# EAGLE design Pure Digit (EAGLE 9.2.2)

## Sheet 1 of 4: Microprocessor
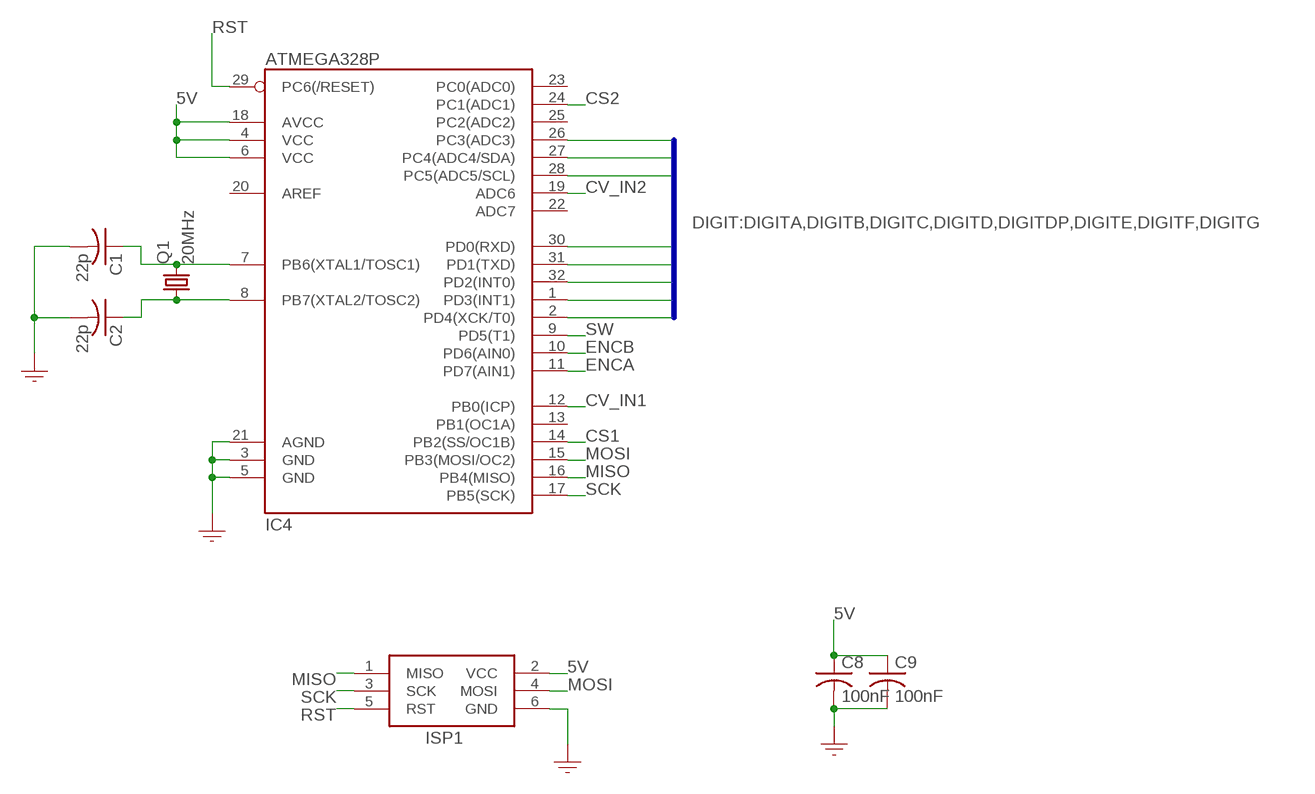
[diagram p0: schematic, sheet 1]

### Parts
C1  22p  CAPACITOR-USC0805  [C0805]
C2  22p  CAPACITOR-USC0805  [C0805]
C8  100nF  CAPACITOR-USC0805  [C0805]
C9  100nF  CAPACITOR-USC0805  [C0805]
IC4  ATMEGA328P  MICROPROCESSOR_ATMEGA328_SMT  [TQFP32-08]
ISP1  HEADER2X3-6  [AVRISP]
Q1  20MHz  CRYSTALSM49  [SM49]

### Nets
5V: C8.1 C9.1 IC4.4(VCC) IC4.6(VCC) IC4.18(AVCC) ISP1.2(VCC) ; also sheet 2,3,4
CS1: IC4.14(PB2(SS/OC1B)) ; also sheet 4
CS2: IC4.24(PC1(ADC1)) ; also sheet 3
CV_IN1: IC4.12(PB0(ICP)) ; also sheet 3
CV_IN2: IC4.19(ADC6) ; also sheet 3
DIGITA: IC4.30(PD0(RXD)) ; also sheet 4
DIGITB: IC4.28(PC5(ADC5/SCL)) ; also sheet 4
DIGITC: IC4.27(PC4(ADC4/SDA)) ; also sheet 4
DIGITD: IC4.26(PC3(ADC3)) ; also sheet 4
DIGITDP: IC4.1(PD3(INT1)) ; also sheet 4
DIGITE: IC4.2(PD4(XCK/T0)) ; also sheet 4
DIGITF: IC4.32(PD2(INT0)) ; also sheet 4
DIGITG: IC4.31(PD1(TXD)) ; also sheet 4
ENCA: IC4.11(PD7(AIN1)) ; also sheet 3
ENCB: IC4.10(PD6(AIN0)) ; also sheet 3
GND: C1.2 C2.2 C8.2 C9.2 IC4.3(GND) IC4.5(GND) IC4.21(AGND) ISP1.6(GND) ; also sheet 2,3,4
MISO: IC4.16(PB4(MISO)) ISP1.1(MISO) ; also sheet 3
MOSI: IC4.15(PB3(MOSI/OC2)) ISP1.4(MOSI) ; also sheet 3,4
N$1: C1.1 IC4.7(PB6(XTAL1/TOSC1)) Q1.2
N$2: C2.1 IC4.8(PB7(XTAL2/TOSC2)) Q1.1
RST: IC4.29(PC6(/RESET)) ISP1.5(RST)
SCK: IC4.17(PB5(SCK)) ISP1.3(SCK) ; also sheet 3,4
SW: IC4.9(PD5(T1)) ; also sheet 3
Unconnected: IC4.13(PB1(OC1A)) IC4.20(AREF) IC4.22(ADC7) IC4.23(PC0(ADC0)) IC4.25(PC2(ADC2))

### Buses
DIGIT:DIGITA,DIGITB,DIGITC,DIGITD,DIGITDP,DIGITE,DIGITF,DIGITG

## Sheet 2 of 4: Power
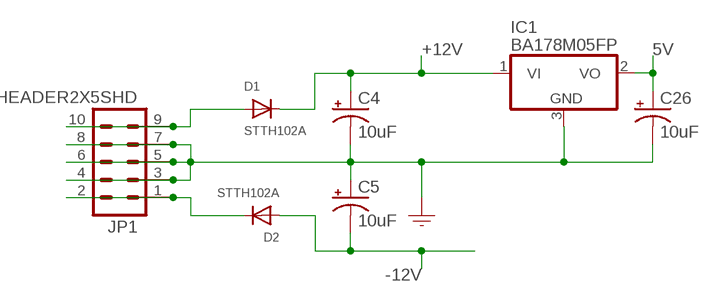
[diagram p1: schematic, sheet 2]

### Parts
C4  10uF  CAPACITOR_POL-US153CLV-0505  [153CLV-0505]
C5  10uF  CAPACITOR_POL-US153CLV-0505  [153CLV-0505]
C26  10uF  CAPACITOR_POL-US153CLV-0505  [153CLV-0505]
D1  STTH102A  DIODESMA  [SMADIODE]
D2  STTH102A  DIODESMA  [SMADIODE]
IC1  BA178M05FP  VOLTAGE_REG_POS05DT  [TO252]
JP1  HEADER2X5SHD  [2X5-SHROUDED]

### Nets
5V: C26.+ IC1.2(VO) ; also sheet 1,3,4
+12V: C4.+ D1.C IC1.1(VI) ; also sheet 3
-12V: C5.- D2.A ; also sheet 3
GND: C4.- C5.+ C26.- IC1.3(GND) JP1.3 JP1.4 JP1.5 JP1.6 JP1.7 JP1.8 ; also sheet 1,3,4
N$9: D1.A JP1.9 JP1.10
N$10: D2.C JP1.1 JP1.2

## Sheet 3 of 4: Inputs
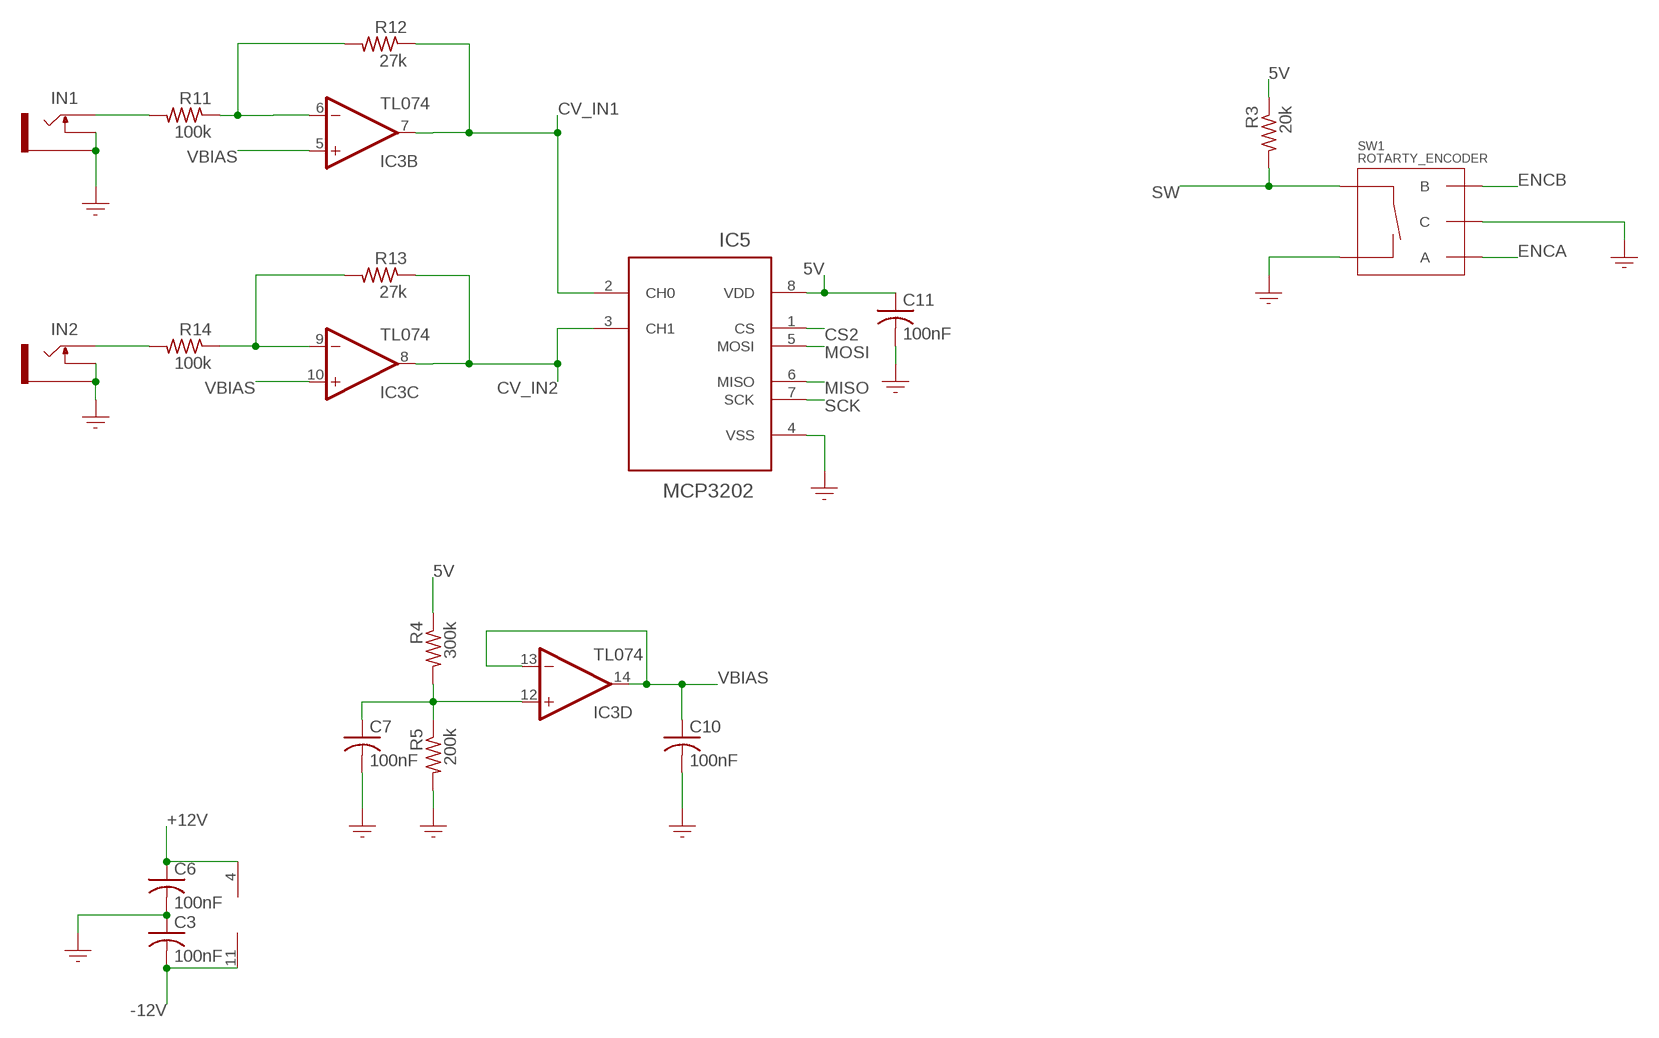
[diagram p2: schematic, sheet 3]

### Parts
C3  100nF  CAPACITOR-USC0805  [C0805]
C6  100nF  CAPACITOR-USC0805  [C0805]
C7  100nF  CAPACITOR-USC0805  [C0805]
C10  100nF  CAPACITOR-USC0805  [C0805]
C11  100nF  CAPACITOR-USC0805  [C0805]
IC3  TL074  OPAMP_QUADD  [SO14]
IC5  MCP3202  ADC_DUAL_12B_MCP3202  [SOIC--8]
IN1  PJ301M-12  SOCKET_MONO_3.5MMPJ301M-12  [PJ301M-12]
IN2  PJ301M-12  SOCKET_MONO_3.5MMPJ301M-12  [PJ301M-12]
R3  20k  RESISTOR_USR0805  [R0805]
R4  300k  RESISTOR_USR0805  [R0805]
R5  200k  RESISTOR_USR0805  [R0805]
R11  100k  RESISTOR_USR0805  [R0805]
R12  27k  RESISTOR_USR0805  [R0805]
R13  27k  RESISTOR_USR0805  [R0805]
R14  100k  RESISTOR_USR0805  [R0805]
SW1  ROTARTY_ENCODER  [ROTARY_ENC_PLAIN]

### Nets
5V: C11.1 IC5.8(VDD) R3.1 R4.1 ; also sheet 1,2,4
+12V: C6.1 IC3.4(P:V+) ; also sheet 2
-12V: C3.2 IC3.11(P:V-) ; also sheet 2
CS2: IC5.1(CS) ; also sheet 1
CV_IN1: IC3.7(B:OUT) IC5.2(CH0) R12.1 ; also sheet 1
CV_IN2: IC3.8(C:OUT) IC5.3(CH1) R13.1 ; also sheet 1
ENCA: SW1.A ; also sheet 1
ENCB: SW1.B ; also sheet 1
GND: C3.1 C6.2 C7.2 C10.2 C11.2 IC5.4(VSS) IN1.GND(SLEEVE) IN1.NORM(SWITCH) IN2.GND(SLEEVE) IN2.NORM(SWITCH) R5.2 SW1.C SW1.SW- ; also sheet 1,2,4
MISO: IC5.6(MISO) ; also sheet 1
MOSI: IC5.5(MOSI) ; also sheet 1,4
N$8: IN1.TIP R11.2
N$11: IN2.TIP R14.2
N$12: C7.1 IC3.12(D:+IN) R4.2 R5.1
N$20: IC3.6(B:-IN) R11.1 R12.2
N$24: IC3.9(C:-IN) R13.2 R14.1
SCK: IC5.7(SCK) ; also sheet 1,4
SW: R3.2 SW1.SW+ ; also sheet 1
VBIAS: C10.1 IC3.5(B:+IN) IC3.10(C:+IN) IC3.13(D:-IN) IC3.14(D:OUT)

## Sheet 4 of 4: Outputs
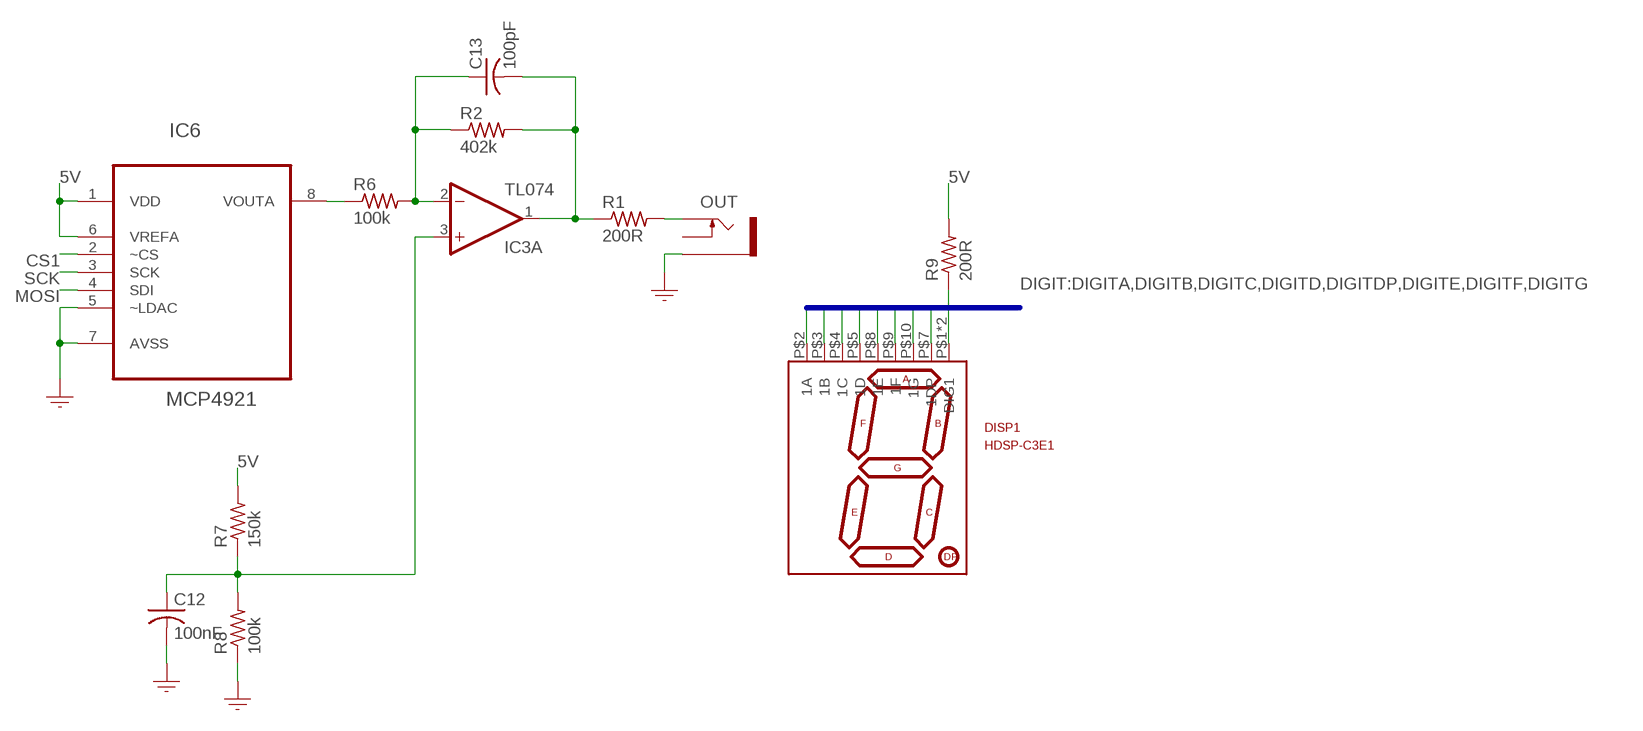
[diagram p3: schematic, sheet 4]

### Parts
C12  100nF  CAPACITOR-USC0805  [C0805]
C13  100pF  CAPACITOR-USC0805  [C0805]
DISP1  HDSP-C3E1  DISPLAY_7-SEGMENT-1DIGIT  [7-SEGMENT-1DIGIT]
IC6  MCP4921  DAC_SINGLE_12B_MCP4921  [SOIC8]
OUT  PJ301M-12  SOCKET_MONO_3.5MMPJ301M-12  [PJ301M-12]
R1  200R  RESISTOR_USR0805  [R0805]
R2  402k  RESISTOR_USR0805  [R0805]
R6  100k  RESISTOR_USR0805  [R0805]
R7  150k  RESISTOR_USR0805  [R0805]
R8  100k  RESISTOR_USR0805  [R0805]
R9  200R  RESISTOR_USR0805  [R0805]

### Nets
5V: IC6.1(VDD) IC6.6(VREFA) R7.2 R9.2 ; also sheet 1,2,3
CS1: IC6.2(~CS) ; also sheet 1
DIGITA: DISP1.P$2(1A) ; also sheet 1
DIGITB: DISP1.P$3(1B) ; also sheet 1
DIGITC: DISP1.P$4(1C) ; also sheet 1
DIGITD: DISP1.P$5(1D) ; also sheet 1
DIGITDP: DISP1.P$7(1DP) ; also sheet 1
DIGITE: DISP1.P$8(1E) ; also sheet 1
DIGITF: DISP1.P$9(1F) ; also sheet 1
DIGITG: DISP1.P$10(1G) ; also sheet 1
GND: C12.2 IC6.5(~LDAC) IC6.7(AVSS) OUT.GND(SLEEVE) R8.1 ; also sheet 1,2,3
MOSI: IC6.4(SDI) ; also sheet 1,3
N$3: C12.1 IC3.3(A:+IN) R7.1 R8.2
N$4: C13.2 IC3.1(A:OUT) R1.1 R2.2
N$5: OUT.TIP R1.2
N$6: IC6.8(VOUTA) R6.1
N$7: C13.1 IC3.2(A:-IN) R2.1 R6.2
N$13: DISP1.P$1(DIG1) DISP1.P$6(DIG1) R9.1
SCK: IC6.3(SCK) ; also sheet 1,3
Unconnected: OUT.NORM(SWITCH)

### Buses
DIGIT:DIGITA,DIGITB,DIGITC,DIGITD,DIGITDP,DIGITE,DIGITF,DIGITG

## Library data of the parts
C1-C3 C6-C13 = GMSN:CAPACITOR-US: Capacitor; SORT: 3
C4 C5 C26 = GMSN:CAPACITOR_POL-US: Electro Capacitor; SORT: 6
D1 D2 = GMSN:DIODE: Diode SMADIODE - SMA Surface Mount Package 20V 1A Schottky Diode Digikey: 641-1014-6-ND DO-1N4148 - Through Hole Small Current Diode SOD-123 20V 1 A (.5mV Vf) Schottky Diode - Digikey: MBRX120TPMSCT-ND SOD-323 10V 570mA (.38mV Vf, 3ns) Schottky Diode - Digikey: ZLLS410CT-ND SOD-523 30V 30mA Schottky Diode (RB751S-40TE61) - Digikey: RB751S-40TE61CT-ND SOT23-R/W - SOT23 Package (R = Solder Paste/Reflow Ovens, W = Hand-Soldering) BAT54Film 40V 300mA - Digikey: 497-7162-1-ND; SORT: 1
DISP1 = GMSN:DISPLAY_7-SEGMENT-1DIGIT: 1 Digit 7 Segment Display - Common Anode; SORT: 9
IC1 = GMSN:VOLTAGE_REG_POS: Positive Voltage Regulator Added bigger pads to the TO-92 package; SORT: 4
IC3 = GMSN:OPAMP_QUAD: OP AMP; SORT: 4
IC4 = GMSN:MICROPROCESSOR_ATMEGA328_SMT: 32-Pin ATMEGA328 Commonly used on Arduino compatible boards Available in QFP and QFN packages TQFP is IC-09069 QFN is non-stock; SORT: 4
IC5 = GMSN:ADC_DUAL_12B_MCP3202: 12bit 2Ch ADC; SORT: 4
IC6 = GMSN:DAC_SINGLE_12B_MCP4921: 12bit DAC; SORT: 4
IN1 IN2 OUT = GMSN:SOCKET_MONO_3.5MM: 3.5 mm Jack Socket; SORT: 8
ISP1 = GMSN:HEADER2X3: AVR ISP Header Standard 6 pin header for AVR programming; SORT: 7
JP1 = GMSN:HEADER2X5: Header 5x2 Standard 10-pin dual row 0.1" header. Commonly used with AVR-ISP. Use with Spark Fun Electronics SKU: PRT-00778; SORT: 7
Q1 = GMSN:CRYSTAL: Crystal; SORT: 6
R1-R9 R11-R14 = GMSN:RESISTOR_US: Resistor; SORT: 2
SW1 = GMSN:ROTARTY_ENCODER: Simple no LED rotary encoder Example: COM-09117; SORT: 8

## Board
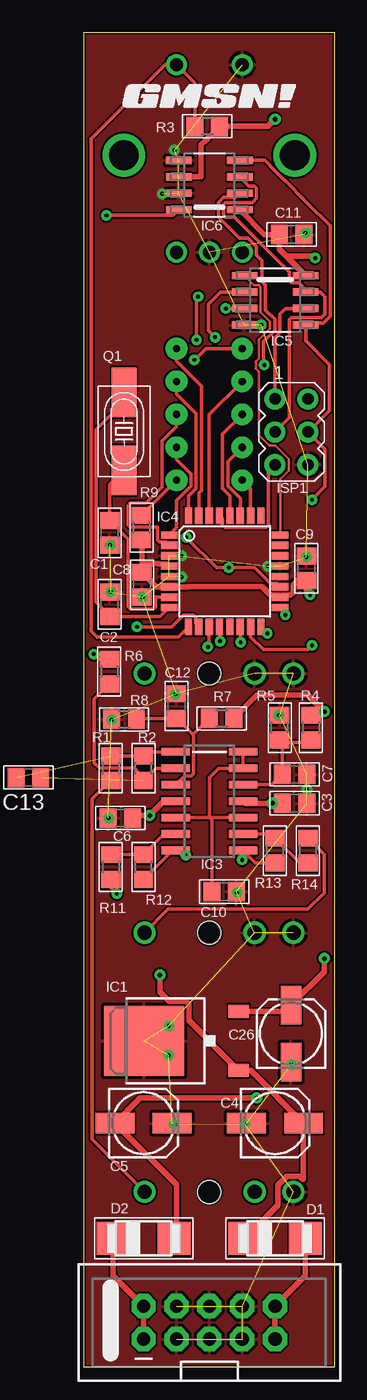
[diagram p4: board, top side]
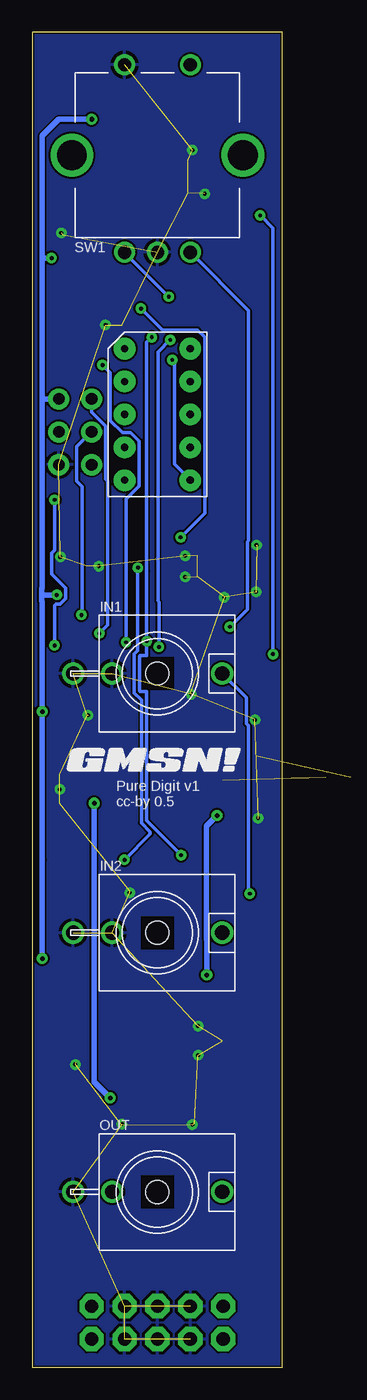
[diagram p5: board, bottom side, seen from below]

Size 19.32 x 103 mm. Coordinates in mm from the lower left corner, seen from the top.
Outline: 19.32,0 0,0 0,103 19.32,103 19.32,0
Copper layers (1*16): Top 0.035mm / dielectric 1.5mm / Bottom 0.035mm
Design rules "PCBWay": minimum track width 6mil, minimum drill 12mil, track to track 6mil, track to pad 6mil, pad to pad 6mil, via to via 6mil, smd to smd 6mil, copper to edge 6mil, drill to drill 6mil, minimum pad ring 12mil, minimum via ring 10mil, stop-mask expansion 4mil, vias tented up to drill 25mil, thermal gap 10mil

### Footprints (pad centres in the part's own frame; a part is rotated, then mirrored left to right if it is on the bottom)
C0805 = smd 1.3 x 1.5: 1 -0.95,0; 2 0.95,0
153CLV-0505 = smd 3 x 1.6: + 2.2,0; - -2.2,0
SMADIODE = smd 2.54 x 2.54: A 2.349,0; C -2.349,0
7-SEGMENT-1DIGIT = drill 0.55 pad 1.676: P$1 -2.54,5.08; P$2 -2.54,2.54; P$3 -2.54,0; P$4 -2.54,-2.54; P$5 -2.54,-5.08; P$6 2.54,-5.08; P$7 2.54,-2.54; P$8 2.54,0; P$9 2.54,2.54; P$10 2.54,5.08
TO252 = smd 1 x 1.6: 1 -2.28,-4.8; 2 2.28,-4.8 | smd 5.4 x 6.2: 3 0,2.5
SO14 = smd 0.6 x 2.2: 1 -3.81,-2.6; 2 -2.54,-2.6; 3 -1.27,-2.6; 4 0,-2.6; 5 1.27,-2.6; 6 2.54,-2.6; 7 3.81,-2.6; 8 3.81,2.6; 9 2.54,2.6; 10 1.27,2.6; 11 0,2.6; 12 -1.27,2.6; 13 -2.54,2.6; 14 -3.81,2.6
TQFP32-08 = smd 1.27 x 0.559: 1 -4.293,2.8; 2 -4.293,2; 3 -4.293,1.2; 4 -4.293,0.4; 5 -4.293,-0.4; 6 -4.293,-1.2; 7 -4.293,-2; 8 -4.293,-2.8; 17 4.293,-2.8; 18 4.293,-2; 19 4.293,-1.2; 20 4.293,-0.4; 21 4.293,0.4; 22 4.293,1.2; 23 4.293,2; 24 4.293,2.8 | smd 0.559 x 1.27: 9 -2.8,-4.293; 10 -2,-4.293; 11 -1.2,-4.293; 12 -0.4,-4.293; 13 0.4,-4.293; 14 1.2,-4.293; 15 2,-4.293; 16 2.8,-4.293; 25 2.8,4.293; 26 2,4.293; 27 1.2,4.293; 28 0.4,4.293; 29 -0.4,4.293; 30 -1.2,4.293; 31 -2,4.293; 32 -2.8,4.293
SOIC--8 = smd 1.981 x 0.559: 1 -2.362,1.905; 2 -2.362,0.635; 3 -2.362,-0.635; 4 -2.362,-1.905; 5 2.362,-1.905; 6 2.362,-0.635; 7 2.362,0.635; 8 2.362,1.905
SOIC8 = smd 1.981 x 0.559: 1 -2.362,1.905; 2 -2.362,0.635; 3 -2.362,-0.635; 4 -2.362,-1.905; 5 2.362,-1.905; 6 2.362,-0.635; 7 2.362,0.635; 8 2.362,1.905
PJ301M-12 = drill 1.1: GND 0,-6.5; NORM 0,-3.5; TIP 0,5 | hole 1.778: 0,0
AVRISP = drill 0.9 pad 1.626: 1 -1.27,2.54; 2 1.27,2.54; 3 -1.27,0; 4 1.27,0; 5 -1.27,-2.54; 6 1.27,-2.54
2X5-SHROUDED = drill 1.016 pad 1.88 octagon: 1 -1.27,5.08; 2 1.27,5.08; 3 -1.27,2.54; 4 1.27,2.54; 5 -1.27,0; 6 1.27,0; 7 -1.27,-2.54; 8 1.27,-2.54; 9 -1.27,-5.08; 10 1.27,-5.08
SM49 = smd 3.81 x 1.93: 1 -3,0; 2 3,0
R0805 = smd 1.3 x 1.5: 1 -0.95,0; 2 0.95,0
ROTARY_ENC_PLAIN = drill 1.016: A 7.493,-2.54; B 7.493,2.54; C 7.493,0; SW+ -6.985,2.54; SW- -6.985,-2.54 | drill 2.286: P$3 0,6.604; P$4 0,-6.604

### Placement (x,y rotation side)
C1  1.96,64.39 270 top
C2  1.96,58.87 90 top
C3  16.25,43.52 180 top
C4  14.74,18.83 0 top
C5  4.58,18.83 0 top
C6  2.79,42.36 180 top
C7  16.25,45.74 0 top
C8  4.46,60.38 270 top
C9  17.16,61.65 90 top
C10  10.81,36.69 0 top
C11  16.01,87.41 0 top
C12  7.12,51.02 90 top
C13  -4.31,45.5 180 top  (outside the outline)
C26  15.97,25.74 90 top
D1  14.74,9.94 0 top
D2  4.58,9.94 0 top
DISP1  9.66,73.52 0 bottom
IC1  7.12,25.18 90 top
IC3  9.66,43.67 270 top
IC4  10.85,61.41 0 top
IC5  14.74,82.33 0 top
IC6  9.66,91.22 180 top
IN1  9.66,53.52 270 bottom
IN2  9.66,33.52 270 bottom
ISP1  16.01,72.17 0 top
JP1  9.66,3.43 90 top
OUT  9.66,13.52 270 bottom
Q1  3.07,72.21 270 top
R1  2.04,46.21 270 top
R2  4.58,46.21 90 top
R3  9.5,95.74 180 top
R4  17.52,49.35 270 top
R5  15.1,49.35 90 top
R6  1.92,53.68 270 top
R7  10.61,50.06 0 top
R8  3.07,49.98 0 top
R9  4.42,64.79 270 top
R11  2.04,38.59 270 top
R12  4.58,38.59 90 top
R13  14.74,39.86 90 top
R14  17.28,39.86 90 top
SW1  9.66,93.52 270 bottom
U$1  [GMSN!_LOGO]  9.66,46.77 0 bottom
U$2  [GMSN!_LOGO]  9.94,98.01 0 top

### Tracks (layer width: path | path; a pad name or v marks a point on that pad's centre or on a via)
5V  (via drill 0.3, 0.35)
  Top 0.406: v18.55,31.53 18.55,30.51 C26.+ 15.49,27.46 IC1.2 | 14.46,96.3 v14.74,96.3 14.18,95.74 R3.1 9.56,94.85 9.35,94.64 9.03,94.32 9.03,91.85 IC6.6 | IC6.1 13.93,87.41 C11.1 15.06,86.28 15.6,85.73 | 15.6,85.73 16.24,85.1 IC5.8 | R9.2 4.46,63.8 4.46,62.01 | 4.46,62.01 C8.1 5.36,60.44 5.57,60.23 5.58,60.21 IC4.6 7.94,60.21 7.96,60.23 13.71,60.23 14.36,59.58 14.98,59.58 IC4.18 15.31,59.58 15.93,59.58 16.13,59.79 16.13,60.41 16.43,60.7 C9.1 17.16,59.87 v17.44,59.59 | IC4.4 6.39,61.98 5.78,61.98 5.75,62.01 4.46,62.01 | R4.1 18.27,50.3 v18.55,50.58 17.28,51.85 13.35,51.85 R7.2 | 15.6,85.73 17.69,85.73 v17.84,85.58
  Bottom 0.254: 18.55,59.59 18.55,60.02 18.61,60.07
  Bottom 0.406: v18.55,31.53 18.55,39.15 v18.55,50.58 18.55,59.05 18.61,59.11 18.61,60.07 18.55,60.13 18.55,74.71 | 18.55,74.71 18.55,85.66 | 18.55,85.66 18.55,95.03 17.28,96.3 v14.74,96.3 | 18.55,74.71 ISP1.2 | v17.84,85.58 18.47,85.58 18.55,85.66 | v17.44,59.59 18.55,59.59
+12V  (via drill 0.35)
  Top 0.406: D1.C 14.95,12.5 14.95,14.02 15.66,14.73 16.66,14.73 16.9,14.49 16.94,14.49 C4.+ 12.87,22.9 IC1.1 8.08,26.74 8.08,28.03 7.87,28.24 6.58,28.24 5.85,28.97 v5.85,30.26 | C6.1 3.94,42.56 v5.06,42.56 6.17,43.67 IC3.4
  Bottom 0.406: v5.85,30.26 5.85,33 5.87,33.02 5.87,41.75 v5.06,42.56
-12V  (via drill 0.35)
  Top 0.406: v13.31,20.78 4.33,20.78 C5.- 7.12,14.09 7.12,9.94 D2.A | C3.2 v14.54,43.52 12.42,43.52 IC3.11
  Bottom 0.406: v13.31,20.78 14.54,22 v14.54,43.52
CS1  (via drill 0.3)
  Top 0.254: IC6.2 11.72,90.28 10.75,90.28 10.35,89.88 10.35,88.75 11.98,87.12 12.65,87.12 13.29,86.48 13.29,85.8 13.73,85.37 13.73,83.78 14,83.51 14,81.56 14.71,80.85 14.71,79.99 13.85,79.14 13.85,77.67 13.73,77.54 13.73,77.51 v13.91,77.33 | v12.08,55.94 12.08,57.09 IC4.14
  Bottom 0.254: v13.91,77.33 13.32,76.74 13.32,73.06 12.36,72.1 11.74,72.1 11.08,71.44 11.08,67.98 12.08,66.98 v12.08,55.94
CS2
  Top 0.203: IC4.24 15.14,68.52 15.81,69.19 15.81,70.07 14.78,71.1 14.3,71.1 13.47,71.93 13.47,76.83 13.25,77.06 13.25,77.6 13.47,77.82 13.47,79.3 14.33,80.15 14.33,80.7 13.62,81.4 13.62,83.35 13.47,83.5 13.11,83.5 IC5.1
CV_IN1  (via drill 0.3)
  Top 0.254: R12.1 6.8,39.86 6.92,39.86 | 6.92,39.86 IC3.7 | IC5.2 10.53,82.96 9.58,82.01 9.58,79.99 v10.1,79.47 | v10.49,56.02 10.49,57.08 IC4.12 | v7.83,39.51 7.48,39.86 6.92,39.86
  Bottom 0.254: v7.83,39.51 10.49,42.17 10.49,52.12 10.98,52.12 11.06,52.2 11.06,54.84 10.98,54.92 10.49,54.92 v10.49,56.02 10.49,61.4 10.48,61.41 10.48,79.08 v10.1,79.47
CV_IN2  (via drill 0.3)
  Top 0.254: R13.1 13.21,38.91 12.39,39.74 | 12.39,39.74 IC3.8 | IC4.19 14.9,60.46 14.39,60.46 13.16,61.69 v11.17,61.69 10.22,61.69 v7.87,64.03 | v10.93,81.69 IC5.3 | v12.2,39.15 12.39,39.34 12.39,39.74
  Bottom 0.254: v10.93,81.69 9.26,80.03 6.56,80.03 6,79.47 6,65.91 v7.87,64.03 | v12.2,39.15 10.22,41.13 10.22,41.31 10.9,42 10.9,51.46 11.46,52.03 11.46,55.01 11.18,55.3 11.18,58.2 | 11.18,59.36 11.18,58.2 | 11.18,58.2 v11.18,61.68 v11.17,61.69
DIGITA
  Top 0.254: DISP1.P$2 9.65,73.51 IC4.30
DIGITB
  Top 0.254: IC4.28 11.25,67.23 10.68,67.81 10.68,72 DISP1.P$3
DIGITC
  Top 0.254: IC4.27 12.05,67.01 11.08,67.98 11.08,69.86 DISP1.P$4
DIGITD
  Top 0.254: IC4.26 12.85,67.79 DISP1.P$5
DIGITDP
  Top 0.254: IC4.1 7.12,64.78 7.12,66.86 8.24,67.98 8.24,68.9 7.12,70.02 DISP1.P$7
DIGITE
  Top 0.254: DISP1.P$8 7.12,72.56 6,71.44 6,67.9 4.77,66.67 3.56,66.67 3.39,66.5 3.39,64.97 3.56,64.81 5.64,64.81 5.64,63.82 5.81,63.66 6.32,63.66 IC4.2
DIGITF
  Top 0.254: DISP1.P$9 7.12,75.1 8.64,73.58 8.64,67.81 8.05,67.21 IC4.32
DIGITG
  Top 0.254: DISP1.P$10 7.12,77.64 9.05,75.71 9.05,67.64 8.85,67.44 IC4.31
ENCA  (via drill 0.3)
  Top 0.254: v9.54,55.58 9.65,55.69 IC4.11 | v8.67,79.27 8.67,82.49 v8.79,82.61
  Bottom 0.254: v9.54,55.58 9.54,59.06 9.63,59.15 9.63,78.31 v8.67,79.27 | v8.79,82.61 SW1.A
ENCB  (via drill 0.3)
  Top 0.254: v4.06,57.13 6.75,57.13 7.65,58.04 8.45,58.04 8.61,57.87 8.61,57.36 IC4.10
  Bottom 0.254: SW1.B 2.63,81.54 2.63,63.77 2.72,63.68 2.72,58.47 v4.06,57.13
GND  (via drill 0.3)  (57 unrouted)
  other vias: 11.8,36.61 1.88,42.36 17.2,44.59 15.02,50.3 7.04,51.93 2.12,49.94 2.04,59.83 4.5,59.39 17.16,62.53 2,63.44 17.08,87.53 6.96,93.92 6.01,90.55 13.67,80.42 7.52,62.61 7.52,60.98 14.18,61.81 16.01,23.35 12.4,18.75 6.96,18.71 6.52,26.33 6.52,24.07
  pour Bottom: 0.77,103.92 19.82,103.92 19.82,-1.49 -0.5,-1.49 -0.5,103.92
  pour Top: -0.5,103.92 21.09,103.92 21.09,-1.49 -0.5,-1.49
MISO  (via drill 0.3)
  Top 0.254: v14.14,56.61 13.65,57.11 IC4.16 | IC5.6 15.53,81.69 15.11,81.27 15.11,79.83 14.74,79.45 ISP1.1
  Bottom 0.254: ISP1.1 14.74,73.71 13.65,72.62 13.65,68.54 13.5,68.39 13.5,57.26 v14.14,56.61
MOSI  (via drill 0.3)
  Top 0.254: ISP1.4 17.3,72.15 | 17.3,72.15 18.59,70.86 18.59,67.96 17.6,66.97 v17.6,66.93 | v17.6,55.7 17.28,55.38 13.83,55.38 12.85,56.36 IC4.15 | 17.3,72.15 18.95,73.8 18.95,77.37 17.1,79.21 IC5.5 17.25,80.58 18.48,80.58 19,81.09 19,88.08 17.2,89.87 | 17.2,89.87 16.76,90.31 | IC6.4 13.95,93.12 14.33,92.74 14.33,92.72 15.46,91.59 15.48,91.59 17.2,89.87
  Bottom 0.254: v17.6,55.7 17.6,58.78 17.47,58.91 17.16,58.91 16.75,59.31 16.75,60.1 17.84,61.19 17.84,62.81 17.6,63.06 v17.6,66.93
N$1
  Top 0.254: IC4.7 5.49,59.41 5.49,58.67 5.33,58.5 3.59,58.5 3.39,58.71 3.39,63.91 C1.1 1.96,68.1 Q1.2
N$2
  Top 0.254: IC4.8 5.87,57.92 C2.1 1.96,58.03 0.93,59.06 0.93,72.33 3.31,74.71 3.31,74.97 Q1.1
N$3
  Top 0.254: R7.1 8.44,48.84 | IC3.3 7.75,45.64 8.28,45.64 8.44,45.8 8.44,48.84 | 8.44,48.84 8.35,48.84 C12.1 4.1,50.07 R8.2
N$4  (1 unrouted)
  Top 0.254: IC3.1 4.9,47.48 R2.2 R1.1
N$5
  Top 0.254: OUT.TIP 0.6,17.58 0.6,43.83 R1.2
N$6  (via drill 0.3)
  Top 0.254: R6.1 1.13,54.63 v0.73,55.02 | v1.72,88.88 6.86,88.88 IC6.8
  Bottom 0.254: v0.73,55.02 0.73,87.89 v1.72,88.88
N$7  (1 unrouted)
  Top 0.254: R2.1 4.7,45.38 | 4.7,45.38 5.53,46.21 IC3.2 | R6.2 0.77,51.58 0.77,46.64 1.17,46.23 3.84,46.23 4.7,45.38
N$8  (via drill 0.3)
  Top 0.254: v2.52,36.53 2.04,37.01 R11.2
  Bottom 0.254: IN1.TIP 2.8,51.66 2.8,49.66 2.63,49.49 2.63,36.37 2.52,36.49 v2.52,36.53
N$9
  Top 0.406: JP1.9 JP1.10 17.09,7.05 D1.A
N$10
  Top 0.406: JP1.1 JP1.2 2.23,7.05 D2.C
N$11
  Top 0.254: IN2.TIP 6.48,35.34 17.28,35.34 18.55,36.61 18.55,39.54 R14.2
N$12
  Top 0.254: 15.3,48.2 C7.1 14.5,44.94 IC3.12 | 15.3,48.2 R5.1 | R4.2 17.32,48.2 15.3,48.2
N$13  (via drill 0.3)
  Top 0.254: DISP1.P$6 R9.1 | v8.51,77.73 9.38,78.6 DISP1.P$1
  Bottom 0.254: DISP1.P$6 8.35,69.67 8.35,77.57 v8.51,77.73
N$20
  Top 0.254: IC3.6 6.17,41.13 R12.2 R11.1
N$24
  Top 0.254: IC3.9 14.42,41.13 R13.2 16.64,38.91 R14.1
RST
  Top 0.254: IC4.29 10.69,65.47 10.69,64.96 10.86,64.79 14.05,64.79 14.21,64.96 14.21,69.1 ISP1.5
SCK  (via drill 0.3)
  Top 0.254: v15.53,58.04 15.56,58.61 IC4.17 | ISP1.3 15.83,73.26 15.83,80.82 16,80.98 18.32,80.98 18.59,81.26 18.59,82.61 18.23,82.96 17.28,82.96 | 17.28,82.96 IC5.7 | 17.28,82.96 16.57,83.68 16,83.68 15.83,83.84 15.83,84.51 11.59,88.76 10.92,88.76 10.75,88.92 10.75,89.71 10.92,89.87 12.98,89.87 13.29,90.19 13.29,90.98 13.13,91.14 12.73,91.14 IC6.3
  Bottom 0.254: ISP1.3 15.89,71.02 15.89,68.36 15.49,67.96 15.49,58.08 v15.53,58.04
SW
  Top 0.254: R3.2 8.55,99.07 SW1.SW+ 6.25,100.5 0.52,94.78 0.52,56.82 1.01,56.33 7.26,56.33 IC4.9
VBIAS
  Top 0.254: IC3.5 9.66,42.4 | 9.66,42.4 IC3.10 | C10.1 9.86,42.2 9.66,42.4 | IC3.14 IC3.13 10.37,46.21 9.66,45.5 9.66,42.4

### Text on the board
bNames: Pure Digit v1 / cc-by 0.5